# Altium schematic sheet BlockDiagram.SchDoc
size A3
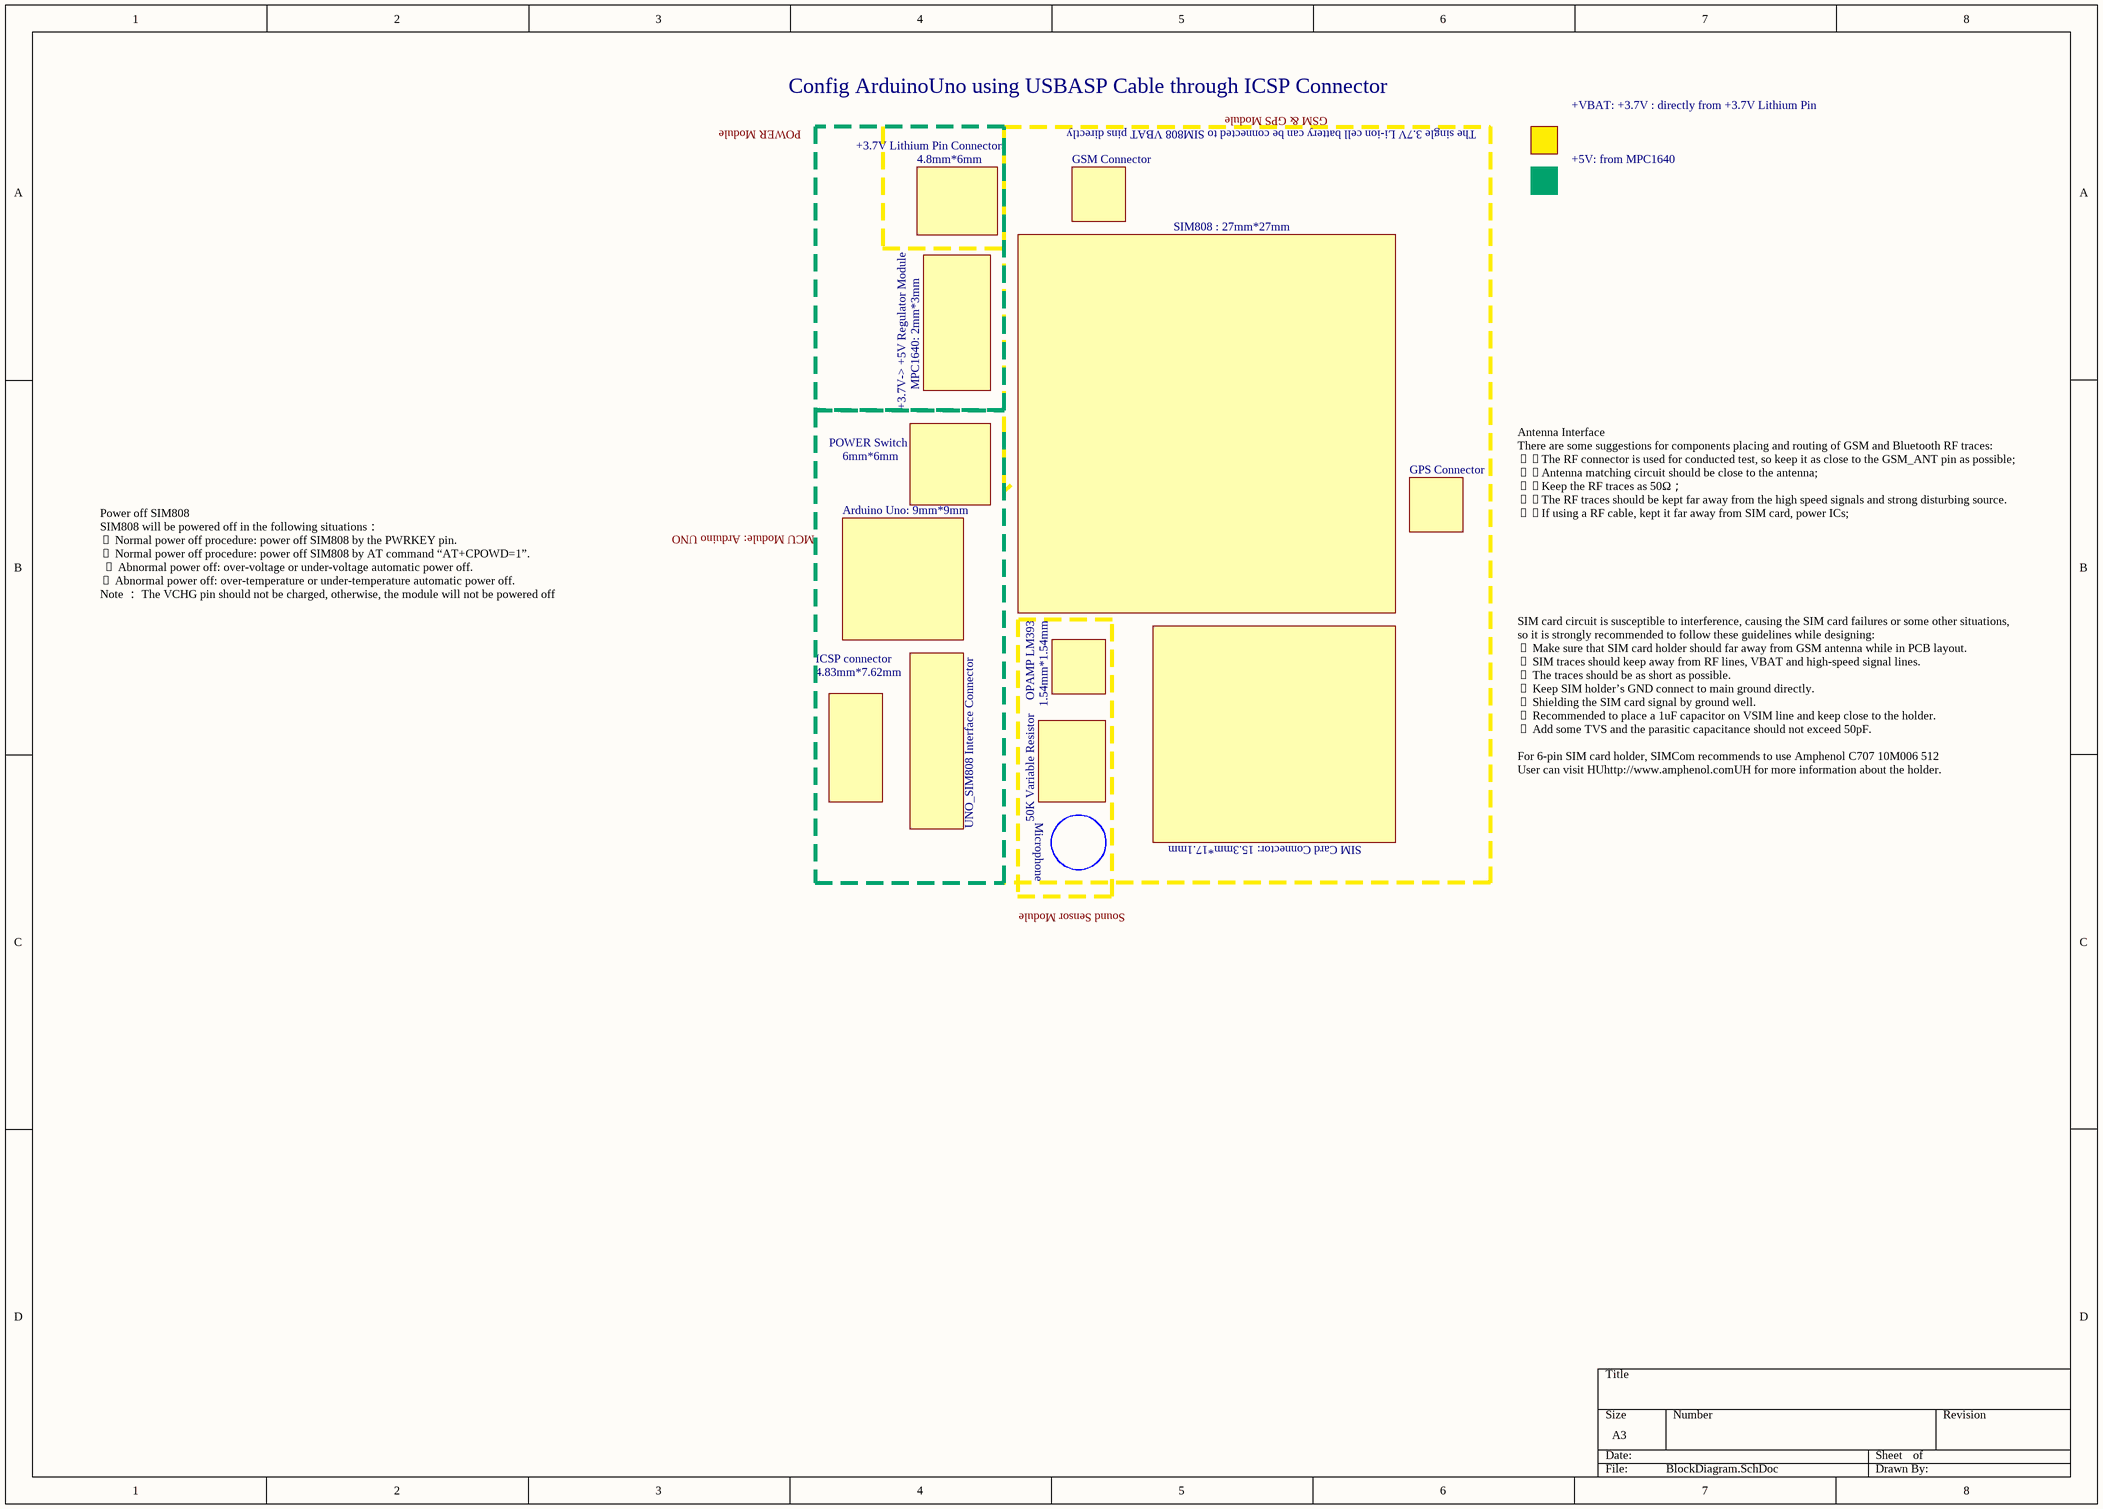
[diagram p0: BlockDiagram.SchDoc]

## Notes on the sheet
- Config ArduinoUno using USBASP Cable through ICSP Connector
- GSM & GPS Module
- +VBAT: +3.7V : directly from +3.7V Lithium Pin
- POWER Module
- +3.7V Lithium Pin Connector
- 4.8mm*6mm
- GSM Connector
- The single 3.7V Li-ion cell battery can be connected to SIM808 VBAT pins directly
- +5V: from MPC1640
- SIM808 : 27mm*27mm
- POWER Switch
- +3.7V-> +5V Regulator Module
- MPC1640: 2mm*3mm
- Arduino Uno: 9mm*9mm
- 6mm*6mm
- GPS Connector
- MCU Module: Arduino UNO
- Antenna Interface
  There are some suggestions for components placing and routing of GSM and Bluetooth RF traces:
  The RF connector is used for conducted test, so keep it as close to the GSM_ANT pin as possible;
  Antenna matching circuit should be close to the antenna;
  Keep the RF traces as 50Ω；
  The RF traces should be kept far away from the high speed signals and strong disturbing source.
  If using a RF cable, kept it far away from SIM card, power ICs;
- Power off SIM808
  SIM808 will be powered off in the following situations：
   Normal power off procedure: power off SIM808 by the PWRKEY pin.
   Normal power off procedure: power off SIM808 by AT command “AT+CPOWD=1”.
   Abnormal power off: over-voltage or under-voltage automatic power off.
   Abnormal power off: over-temperature or under-temperature automatic power off.
  Note ： The VCHG pin should not be charged, otherwise, the module will not be powered off
- 4.83mm*7.62mm
- ICSP connector
- OPAMP LM393
- 1.54mm*1.54mm
- SIM card circuit is susceptible to interference, causing the SIM card failures or some other situations,
  so it is strongly recommended to follow these guidelines while designing:
   Make sure that SIM card holder should far away from GSM antenna while in PCB layout.
   SIM traces should keep away from RF lines, VBAT and high-speed signal lines.
   The traces should be as short as possible.
   Keep SIM holder’s GND connect to main ground directly.
   Shielding the SIM card signal by ground well.
   Recommended to place a 1uF capacitor on VSIM line and keep close to the holder.
   Add some TVS and the parasitic capacitance should not exceed 50pF.
  For 6-pin SIM card holder, SIMCom recommends to use Amphenol C707 10M006 512
  User can visit HUhttp://www.amphenol.comUH for more information about the holder.
- UNO_SIM808 Interface Connector
- Microphone
- 50K Variable Resistor
- SIM Card Connector: 15.3mm*17.1mm
- Sound Sensor Module